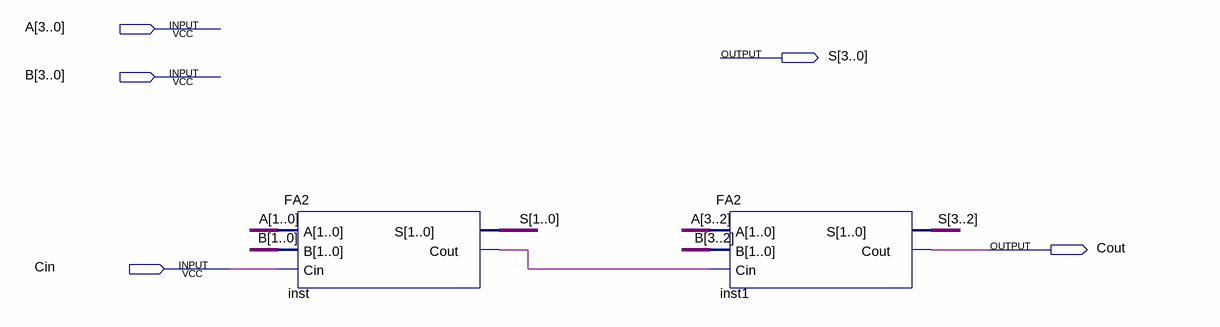
[diagram p0: schematic sheet]
// Quartus schematic FA4.bdf as structural Verilog: 2 symbols, 5 pins
module FA4 (
  input  [3:0] A,
  input  [3:0] B,
  input  Cin,
  output [3:0] S,
  output Cout
);

  wire inst_cout;

  FA2 inst (.A(A[1:0]), .B(B[1:0]), .Cin(Cin), .S(S[1:0]), .Cout(inst_cout));
  FA2 inst1 (.A(A[3:2]), .B(B[3:2]), .Cin(inst_cout), .S(S[3:2]), .Cout(Cout));
endmodule
